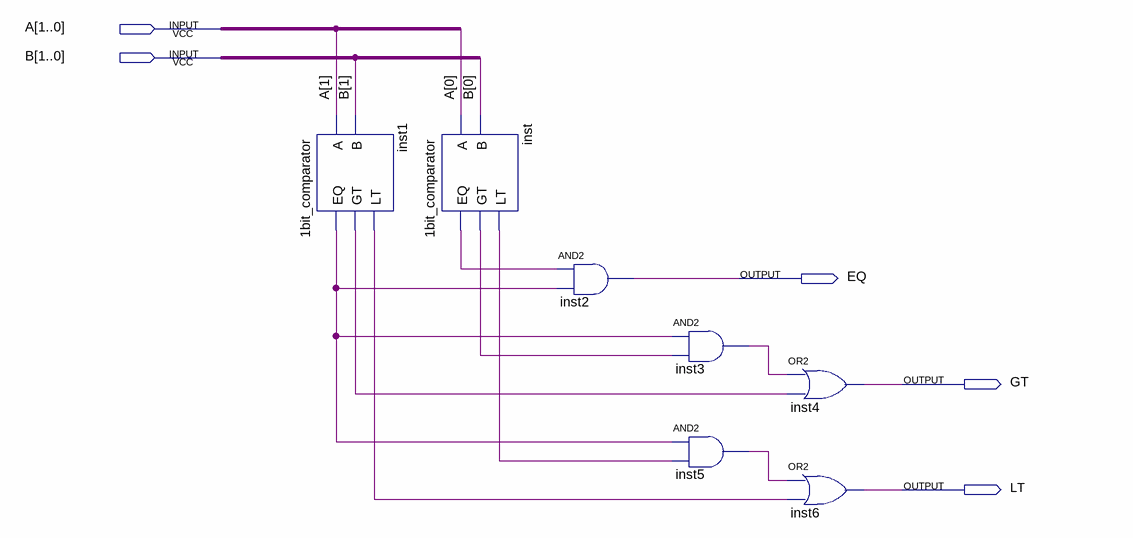
[diagram p0: schematic sheet]
// Quartus schematic 2bit_comparator.bdf as structural Verilog: 7 symbols, 5 pins
module \2bit_comparator  (
  input  [1:0] A,
  input  [1:0] B,
  output EQ,
  output GT,
  output LT
);

  wire inst1_eq, inst1_gt, inst1_lt, inst3_out, inst5_out, inst_eq, inst_gt, inst_lt;

  \1bit_comparator  inst1 (.A(A[1]), .B(B[1]), .EQ(inst1_eq), .GT(inst1_gt), .LT(inst1_lt));
  \1bit_comparator  inst (.A(A[0]), .B(B[0]), .EQ(inst_eq), .GT(inst_gt), .LT(inst_lt));
  and inst2 (EQ, inst_eq, inst1_eq);
  and inst3 (inst3_out, inst1_eq, inst_gt);
  and inst5 (inst5_out, inst1_eq, inst_lt);
  or inst4 (GT, inst3_out, inst1_gt);
  or inst6 (LT, inst5_out, inst1_lt);
endmodule
